# Altium schematic sheet DRV8462.SchDoc: DRV8462 STEPPER DRIVER
size A4; DrawnBy: AX2 ELECTRONICS; Engineer: Aleksandar Aleksic; DocumentNumber: 1; Revision: V2; SheetNumber: 1; SheetTotal: 1
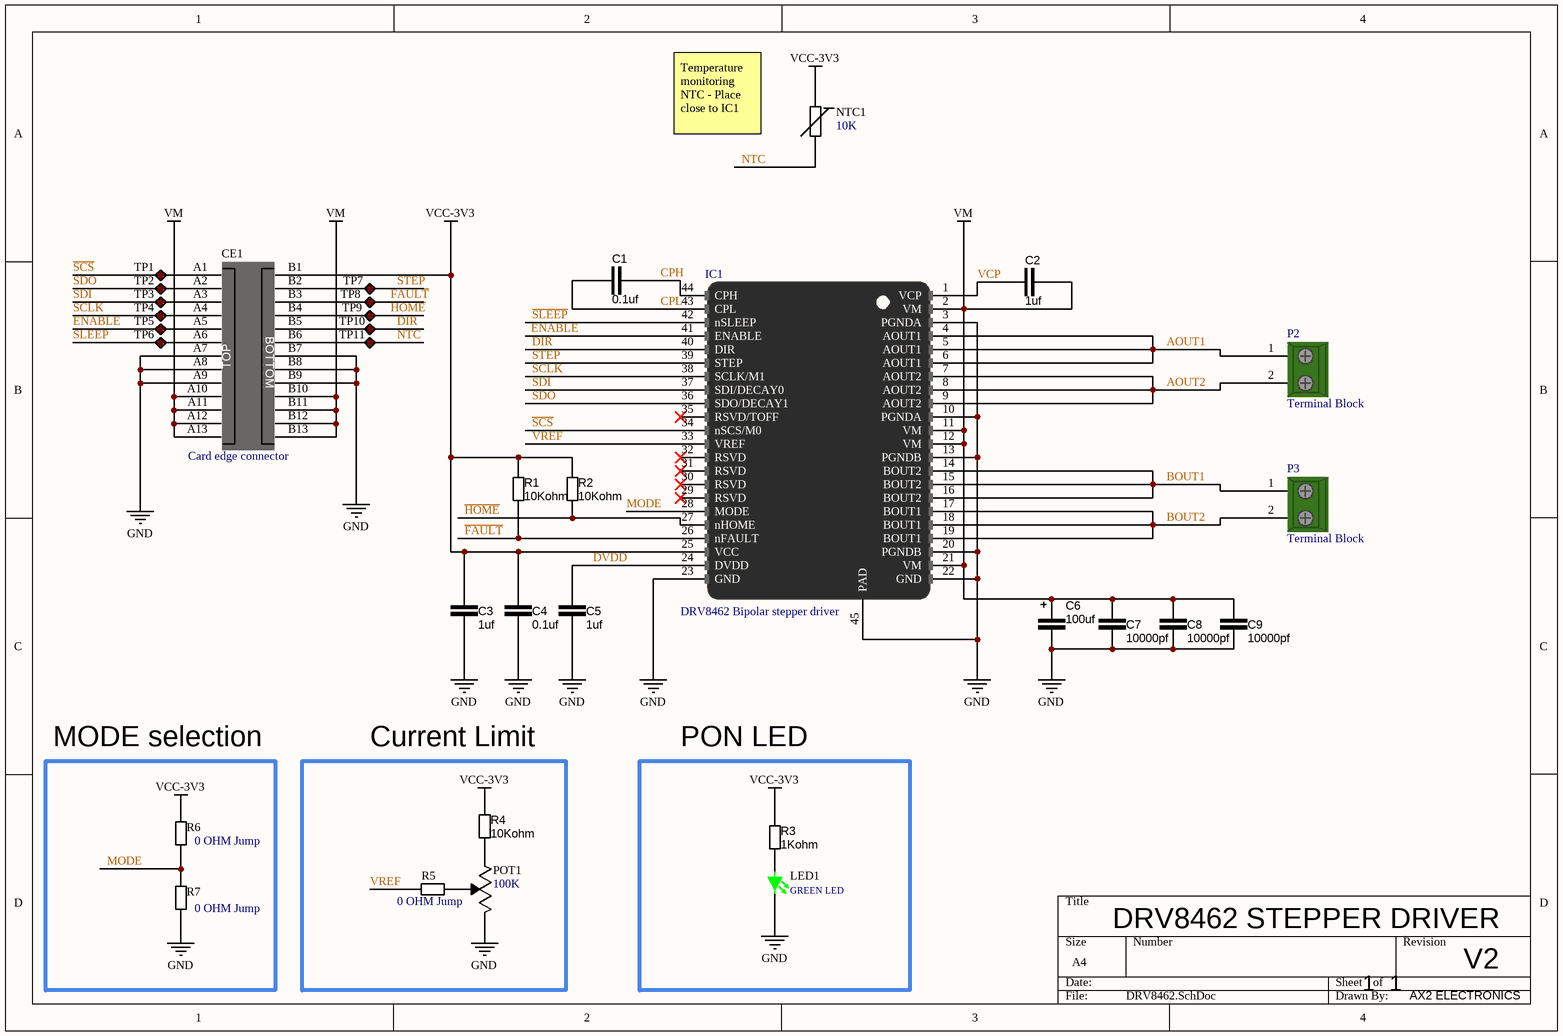
[diagram p0: DRV8462.SchDoc]

## Parts
C1  0.1uf  [CAP_0603]
C2  1uf  [CAP_0603]
C3  1uf  [CAP_0603]
C4  0.1uf  [CAP_0603]
C5  1uf  [CAP_0603]
C6  100uf  [CAPAE7366X60M]
C7  10000pf  [CAP_0603]
C8  10000pf  [CAP_0603]
C9  10000pf  [CAP_0603]
CE1  Card edge connector  [Edge Connector]
IC1  DRV8462 Bipolar stepper driver  [TSOP64P810X120_HS-45N]
LED1  GREEN LED  [DIOC1608X04N]
NTC1  10K  [SMD_0603]
P2  Terminal Block  [TERM_BLOCK 5mm 2PIN]
P3  Terminal Block  [TERM_BLOCK 5mm 2PIN]
POT1  100K  [TC33X-2_POT]
R1  10Kohm  [RES_0603]
R2  10Kohm  [RES_0603]
R3  1Kohm  [RES_0603]
R4  10Kohm  [RES_0603]
R5  0 OHM Jump  [RES_0603]
R6  0 OHM Jump  [RES_0603]
R7  0 OHM Jump  [RES_0603]
TP1  Test point  [TestPoint]  (value not drawn)
TP2  Test point  [TestPoint]  (value not drawn)
TP3  Test point  [TestPoint]  (value not drawn)
TP4  Test point  [TestPoint]  (value not drawn)
TP5  Test point  [TestPoint]  (value not drawn)
TP6  Test point  [TestPoint]  (value not drawn)
TP7  Test point  [TestPoint]  (value not drawn)
TP8  Test point  [TestPoint]  (value not drawn)
TP9  Test point  [TestPoint]  (value not drawn)
TP10  Test point  [TestPoint]  (value not drawn)
TP11  Test point  [TestPoint]  (value not drawn)

## Blocks framed on the sheet
MODE selection: R6 R7
Current Limit: POT1 R4 R5
PON LED: LED1 R3

## Nets
GND: C3.2 C4.1 C5.1 C6.1 C7.1 C8.1 C9.1 CE1.A7 CE1.A8 CE1.A9 CE1.B7 CE1.B8 CE1.B9 IC1.3(PGNDA) IC1.10(PGNDA) IC1.13(PGNDB) IC1.20(PGNDB) IC1.22(GND) IC1.23(GND) IC1.45(PAD) LED1.2 POT1.3 R7.1
VCC-3V3: C3.1 C4.2 CE1.B1 IC1.25(VCC) NTC1.2 R1.2 R2.2 R3.2 R4.2 R6.2
VM: C2.2 C6.2 C7.2 C8.2 C9.2 CE1.A10 CE1.A11 CE1.A12 CE1.A13 CE1.B10 CE1.B11 CE1.B12 CE1.B13 IC1.2(VM) IC1.11(VM) IC1.12(VM) IC1.21(VM)
~{FAULT}: CE1.B3 IC1.26(nFAULT) R1.1 TP8.1
~{HOME}: CE1.B4 IC1.27(nHOME) R2.1 TP9.1
~{SCS}: CE1.A1 IC1.34(nSCS/M0) TP1.1
~{SLEEP}: CE1.A6 IC1.42(nSLEEP) TP6.1
AOUT1: IC1.4(AOUT1) IC1.5(AOUT1) IC1.6(AOUT1) P2.1(pin1)
AOUT2: IC1.7(AOUT2) IC1.8(AOUT2) IC1.9(AOUT2) P2.2(pin2)
BOUT1: IC1.14(BOUT2) IC1.15(BOUT2) IC1.16(BOUT2) P3.1(pin1)
BOUT2: IC1.17(BOUT1) IC1.18(BOUT1) IC1.19(BOUT1) P3.2(pin2)
CPH: C1.2 IC1.44(CPH)
CPL: C1.1 IC1.43(CPL)
DIR: CE1.B5 IC1.40(DIR) TP10.1
DVDD: C5.2 IC1.24(DVDD)
ENABLE: CE1.A5 IC1.41(ENABLE) TP5.1
MODE: IC1.28(MODE) R6.1 R7.2
NTC: CE1.B6 NTC1.1 TP11.1
SCLK: CE1.A4 IC1.38(SCLK/M1) TP4.1
SDI: CE1.A3 IC1.37(SDI/DECAY0) TP3.1
SDO: CE1.A2 IC1.36(SDO/DECAY1) TP2.1
STEP: CE1.B2 IC1.39(STEP) TP7.1
VCP: C2.1 IC1.1(VCP)
VREF: IC1.33(VREF) R5.1
NetLED1_1: LED1.1 R3.1
NetPOT1_1: POT1.1 R4.1
NetPOT1_2: POT1.2 R5.2

Not connected (* = marked no-connect by the designer): IC1 29(RSVD)* 30(RSVD)* 31(RSVD)* 32(RSVD)* 35(RSVD/TOFF)*

## Notes on the sheet
- Temperature monitoring NTC - Place close to IC1
- (in symbol 00000007) BOTTOM; TOP

## Library data of the parts
C1 C4 = 0000012: CAP CER 0.1uF 10V X7R 0603; capaticanse: 0.1uf; ComponentLink1Description: digikey; ComponentLink1URL: https://www.digikey.com/en/products/detail/w%C3%BCrth-elektronik/885012206020/5453794; Digikey part number: 732-7939-2-ND
C2 C5 = 0000009: CAP CER 1uF 0603 16V X7R; capaticanse: 1uf; ComponentLink1Description: digikey; ComponentLink1URL: https://www.digikey.com/en/products/detail/samsung-electro-mechanics/CL10B105KO8NNNC/3886677; DigiKey part number: 1276-1019-2-ND
C3 = 0000011: CAP CER 1uF 10V X7R 0603; capaticanse: 1uf; ComponentLink1Description: digikey; ComponentLink1URL: https://www.digikey.com/en/products/detail/samsung-electro-mechanics/CL10B105KP8NNNC/3887604; DigiKey part number: 1276-1946-2-ND
C6 = 0000013: CAP ALUM POLY 100UF 20% 63V SMD; capaticanse: 100uf; ComponentLink1Description: digikey; ComponentLink1URL: https://www.digikey.com/en/products/detail/kemet/A767MU107M1JLAE028/7392906; DigiKey part number: 399-15648-2-ND
C7-C9 = 0000010: CAP CER 10000PF 63V X7R 0603; capaticanse: 10000pf; ComponentLink1Description: digikey; ComponentLink1URL: https://www.digikey.com/en/products/detail/knowles-syfer/060330630103KXT/6565244; Digikey part number: 1608-1294-2-ND
CE1 = 00000007: Card edge connector 26 PINs
IC1 = DRV8462: 65-V, 10-A, DUAL H-BRIDGE STEPPER DRIVER; Digikey part number: 296-DRV8462DDWRTR-ND; ComponentLink1Description: DigiKey; ComponentLink1URL: https://www.digikey.com/en/products/detail/texas-instruments/DRV8462DDWR/17395001?s=N4IgTCBcDaICYCcBuAOALANggXQL5A; Mouser part number: 595-DRV8462DDWR; ComponentLink2Description: Mouser; ComponentLink2URL: https://eu.mouser.com/ProductDetail/Texas-Instruments/DRV8462DDWR?qs=rQFj71Wb1eVexvYNsDfnvA%3D%3D; ComponentLink3Description: datasheet; ComponentLink3URL: https://www.ti.com/lit/ds/symlink/drv8462.pdf
LED1 = 00000001: LED GREEN DIFFUSED 0603 SMD; Supplier 1: Avnet; Supplier Part Number 1: Q65111A3964; ComponentLink1Description: Digikey; ComponentLink1URL: https://www.digikey.com/en/products/detail/ams-osram-usa-inc/LG-Q396-PS-35/5249855
NTC1 = 00000003: THERMISTOR NTC 10KOHM 3380K 0603; value: 10K; Supplier 1: Arrow Electronics; Supplier Part Number 1: NCP18XH103F03RB; ComponentLink1Description: Digikey; ComponentLink1URL: https://www.digikey.com/en/products/detail/murata-electronics/NCU18XH103F6SRB/7243451
P2 P3 = 00000001: Terminal block 90 deg 5mm 2PIN; ComponentLink1Description: DigiKey; ComponentLink1URL: https://www.digikey.com/en/products/detail/adam-tech/EB20-02-C/9831508; DigiKey part number: 2057-EB20-02-C-ND
POT1 = 00000002: TRIMMER 100K OHM 0.1W J LEAD TOP; Supplier 1: Arrow Electronics; Supplier Part Number 1: TC33X-2-104E; ComponentLink1Description: DigiKey; ComponentLink1URL: https://www.digikey.com/en/products/detail/bourns-inc/TC33X-2-104E/612859; Value: 100K
R1 R2 R4 = R000001: RES 10K OHM 1% 1/10W 0603; resistance: 10Kohm; ComponentLink1Description: digikey; ComponentLink1URL: https://www.digikey.com/en/products/detail/vishay-beyschlag-draloric-bc-components/MCT06030C1002FP500/1850440
R3 = R000004: RES 1K OHM 1% 1/10W 0603; resistance: 1Kohm; ComponentLink1Description: digikey; ComponentLink1URL: https://www.digikey.com/en/products/detail/vishay-beyschlag-draloric-bc-components/MCT06030C1001FP500/2607821
R5-R7 = R000007: RES 0 OHM JUMPER 1/10W 0603; Supplier 1: Arrow Electronics; Supplier Part Number 1: RMCF0603ZT0R00; ComponentLink1Description: DigiKey; ComponentLink1URL: https://www.digikey.com/en/products/detail/stackpole-electronics-inc/RMCF0603ZT0R00/1756908; resistance: 0 OHM Jump
TP1-TP11 = TP002: Test point 1mm